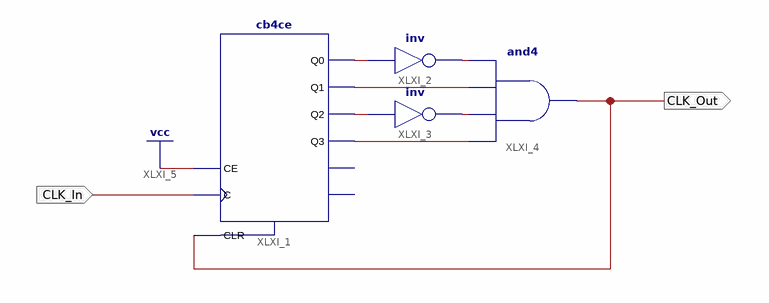
[diagram p0: schematic sheet 1]
// Xilinx ISE schematic mod10.sch (spartan6) as structural Verilog: 4 symbols, 2 ports
module mod10 (
  input  CLK_In,
  output CLK_Out
);

  wire XLXN_5, XLXN_6, XLXN_7, XLXN_8, XLXN_9, XLXN_10;

  cb4ce XLXI_1 (
    .C(CLK_In), .CE(1'b1), .CLR(CLK_Out), .Q0(XLXN_7), .Q1(XLXN_6), .Q2(XLXN_8), .Q3(XLXN_5));  // open: CEO, TC
  not XLXI_2 (XLXN_10, XLXN_7);
  not XLXI_3 (XLXN_9, XLXN_8);
  and XLXI_4 (CLK_Out, XLXN_5, XLXN_9, XLXN_6, XLXN_10);
endmodule
